# Altium project ELEC-DEM-555Timer.PrjPcb
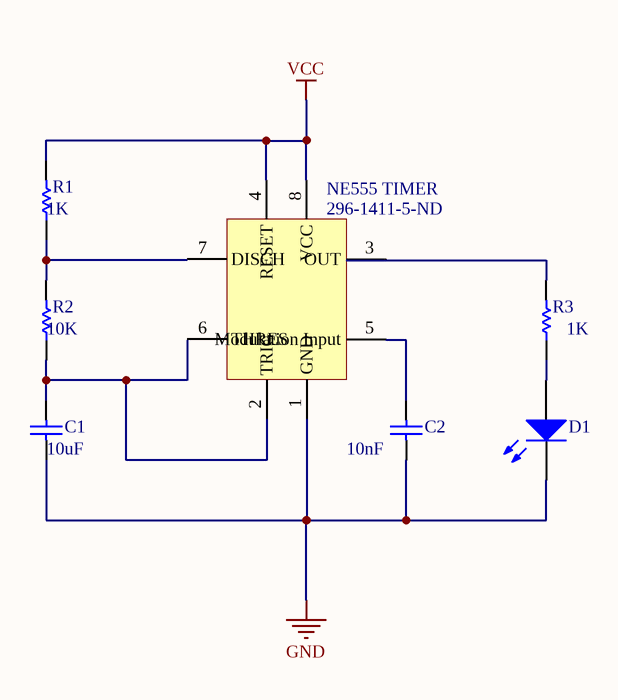
[diagram p0: ELEC-DEM-555Timer schmtc.SchDoc]
1 sheet, 7 parts. Net scope: global (net labels, ports and power ports of the same name join across sheets).

## Sheet ELEC-DEM-555Timer schmtc.SchDoc
size A

### Parts
C1  value 10uF  [RAD-0.3]  (hidden comment: Cap)
C2  value 10nF  [RAD-0.3]
D1  LED0  [LED-0]  (value not drawn)
NE555P_TIMER  NE555 TIMER  Supplier Part Number 2: 296-1411-5-ND
R1  value 1K  [AXIAL-0.3]  (hidden comment: Res1)
R2  value 10K  [AXIAL-0.3]  (hidden comment: Res1)
R3  value 1K  [AXIAL-0.3]  (hidden comment: R3)

### Nets
GND: C1.1 C2.1 D1.2(K) NE555P_TIMER.1(GND)
VCC: NE555P_TIMER.4(RESET) NE555P_TIMER.8(VCC) R1.2
NetC1_2: C1.2 NE555P_TIMER.2(TRIG) NE555P_TIMER.6(THRES) R2.1
NetC2_2: C2.2 NE555P_TIMER.5(Modulation_Input)
NetD1_1: D1.1(A) R3.1
NetNE555P_TIMER_3: NE555P_TIMER.3(OUT) R3.2
NetNE555P_TIMER_7: NE555P_TIMER.7(DISCH) R1.1 R2.2

### Library data of the parts
C1 C2 = Cap: Capacitor; Published: 8-Jun-2000; LatestRevisionDate: 17-Jul-2002; LatestRevisionNote: Re-released for DXP Platform.; PackageReference: RAD-0.3; Publisher: Altium Limited; PackageDescription: Radial Cap, Thru-Hole; 2 Leads; 0.3 in Pin Spacing
D1 = LED0: Typical INFRARED GaAs LED; Published: 8-Jun-2000; LatestRevisionDate: 08-Jul-2005; LatestRevisionNote: Mech Layer 1 removed.; PackageReference: LED-0; Publisher: Altium Limited; PackageDescription: LED; 2 Leads
R1-R3 = Res1: Resistor; Published: 8-Jun-2000; LatestRevisionDate: 17-Jul-2002; LatestRevisionNote: Re-released for DXP Platform.; PackageReference: AXIAL-0.3; Publisher: Altium Limited; PackageDescription: Axial Device, Thru-Hole; 2 Leads; 0.3 in Pin Spacing
NE555P_TIMER = NE555 TIMER: Supplier 1: Digi-Key; Supplier 2: Digi-Key